# Altium schematic sheet Tape.SchDoc
size A4; SheetNumber: 4; SheetTotal: 15
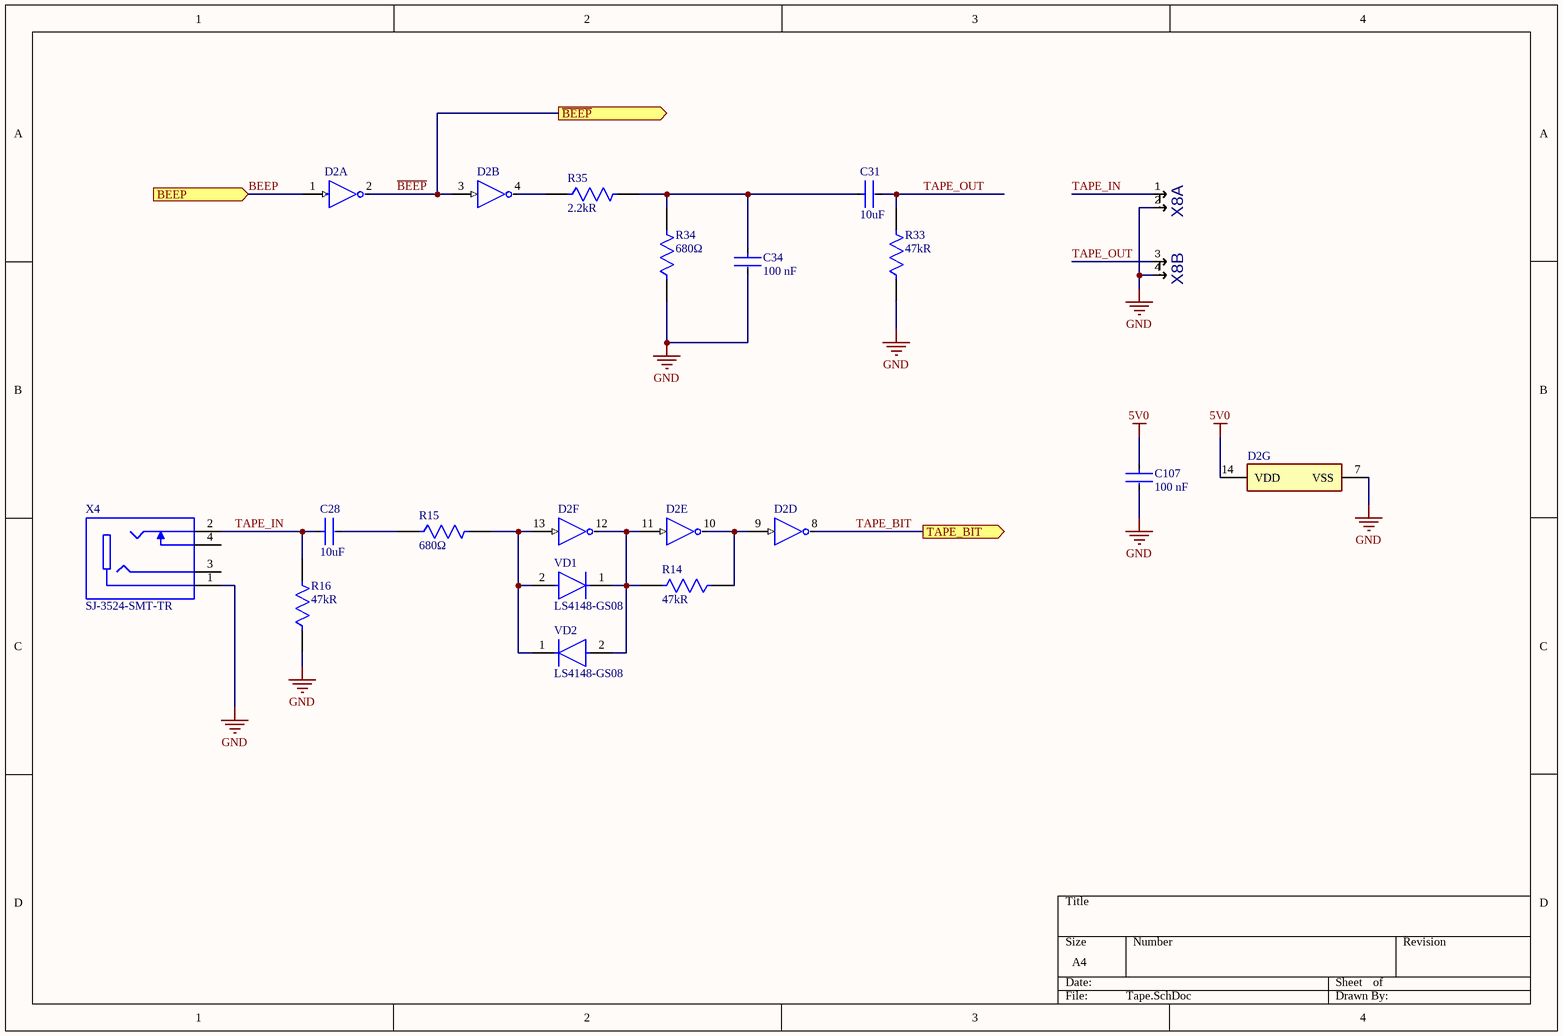
[diagram p0: Tape.SchDoc]

## Parts
C28  Capacitance: 10uF  [FP-C0805C-DG-IPC_A]  (hidden comment: C0805C106K8PACTU)
C31  Capacitance: 10uF  [FP-C0805C-DG-IPC_A]  (hidden comment: C0805C106K8PACTU)
C34  Capacitance: 100 nF  [FP-CC0805-0_85-IPC_A]  (hidden comment: CC0805KRX7R9BB104)
C107  Capacitance: 100 nF  [FP-CC0805-0_85-IPC_A]  (hidden comment: CC0805KRX7R9BB104)
D2  CD4069UBM  [FP-D0014A-IPC_A]  (value not drawn)  (parts A,B,D,E,F,G of 7)
R14  Resistance: 47kR  [FP-CRCW0805-HPe3-IPC_A]  (hidden comment: CRCW080547K0FKEAHP)
R15  value 680Ω  [FP-RT0805-IPC_A]  (hidden comment: RT0805FRE07680RL)
R16  Resistance: 47kR  [FP-CRCW0805-HPe3-IPC_A]  (hidden comment: CRCW080547K0FKEAHP)
R33  Resistance: 47kR  [FP-CRCW0805-HPe3-IPC_A]  (hidden comment: CRCW080547K0FKEAHP)
R34  value 680Ω  [FP-RT0805-IPC_A]  (hidden comment: RT0805FRE07680RL)
R35  Resistance: 2.2kR  [FP-CR0805-IPC_A]  (hidden comment: CR0805-JW-222ELF)
VD1  LS4148-GS08  [FP-6_560-5006_01-4-MFG]
VD2  LS4148-GS08  [FP-6_560-5006_01-4-MFG]
X4  SJ-3524-SMT-TR  [SJ-3524-SMT-TR]
X8  PLB2-2  [PLB2-2]  (value not drawn)  (parts A,B of 2)

## Ports
BEEP (in), TAPE_BIT (out), ~{BEEP} (out)

## Nets
5V0: C107.1 D2.14(VDD)
GND: C34.2 C107.2 D2.7(VSS) R16.1 R33.1 R34.1 X4.1 X8.2 X8.4
~{BEEP}: D2.2(~{A}) D2.3(B) ; port ~{BEEP}
BEEP: D2.1(A) ; port BEEP
TAPE_BIT: D2.8(~{D}) ; port TAPE_BIT
TAPE_IN: C28.1 R16.2 X4.2 X8.1
TAPE_OUT: C31.2 R33.2 X8.3
NetC28_2: C28.2 R15.1
NetC31_1: C31.1 C34.1 R34.2 R35.2
NetD2_4: D2.4(~{B}) R35.1
NetD2_9: D2.9(D) D2.10(~{E}) R14.1
NetD2_11: D2.11(E) D2.12(~{F}) R14.2 VD1.1(C) VD2.2(A)
NetD2_13: D2.13(F) R15.2 VD1.2(A) VD2.1(C)

Not connected (* = marked no-connect by the designer): X4 3 4

## Library data of the parts
C28 C31 = CMP-2007-03243-2: CAP CER 10UF 10V X5R 0805; Manufacturer: KEMET; Manufacturer Part Number: C0805C106K8PACTU; Value: 10uF; Category: Cap; Case/Package: 0805
C34 C107 = CMP-2100-03606-3: CAP CER 0.1UF 50V X7R 0805; Manufacturer: Yageo; Value: 100 nF; Manufacturer Part Number: CC0805KRX7R9BB104; Category: Cap; Case/Package: 0805
D2 = CMP-1615-00195-3: IC INVERTER 6CH 6-INP 14SOIC; Manufacturer: Texas Instruments; Number of Pins: 14; Case/Package: SOIC; Manufacturer Part Number: CD4069UBM; value: CD4069UBM; Category: IC
R14 R16 R33 = CMP-02407-008731-1: RES Thick Film, 47kΩ, 1%, 0.5W, 100ppm/°C, 0805; Manufacturer: Vishay; Number of Terminations: 2; Termination: SMD/SMT; Case/Package: 0805; Manufacturer Part Number: CRCW080547K0FKEAHP; value: 47kΩ; Category: Res
R15 R34 = CMP-03412-000082-1: RES SMD 680 OHM 1% 1/8W 0805; Manufacturer: Yageo; Category: Res; Manufacturer Part Number: RT0805FRE07680RL; Resistance: 680Ω; Case/Package: 0805
R35 = CMP-07231-003724-1: Thick Film Chip Resistors 0805 2.2kΩ 0.125W 5% 200ppm/°C; Manufacturer: Bourns; Number of Terminations: 2; Termination: SMD/SMT; Case/Package: 0805; Manufacturer Part Number: CR0805-JW-222ELF; value: 2.2kΩ; Category: Res
VD1 VD2 = CMP-02540-000025-1: DIODE GEN PURP 75V 150MA SOD80; Manufacturer: Vishay; Capacitance: 4pF; Value: LS4148; Category: Diode; Manufacturer Part Number: LS4148-GS08; Case/Package: SOD80
X4 = SJ-3524-SMT-TR: Connector; Case/Package: Stereo jack smd; Category: Connector; Value: SJ-3524-SMT-TR
X8 = PLB2-2: Value: PLD-4; Case/Package: PLD-4; Category: Connector